# Altium schematic sheet Photodiode.SchDoc
size 420 x 297 mm; Address1: Address1; Address2: Address2; Address3: Address3; Address4: Address4; DocumentNumber: *Э3; SheetNumber: 2; SheetTotal: 14; DocumentType: Схема электрическая *
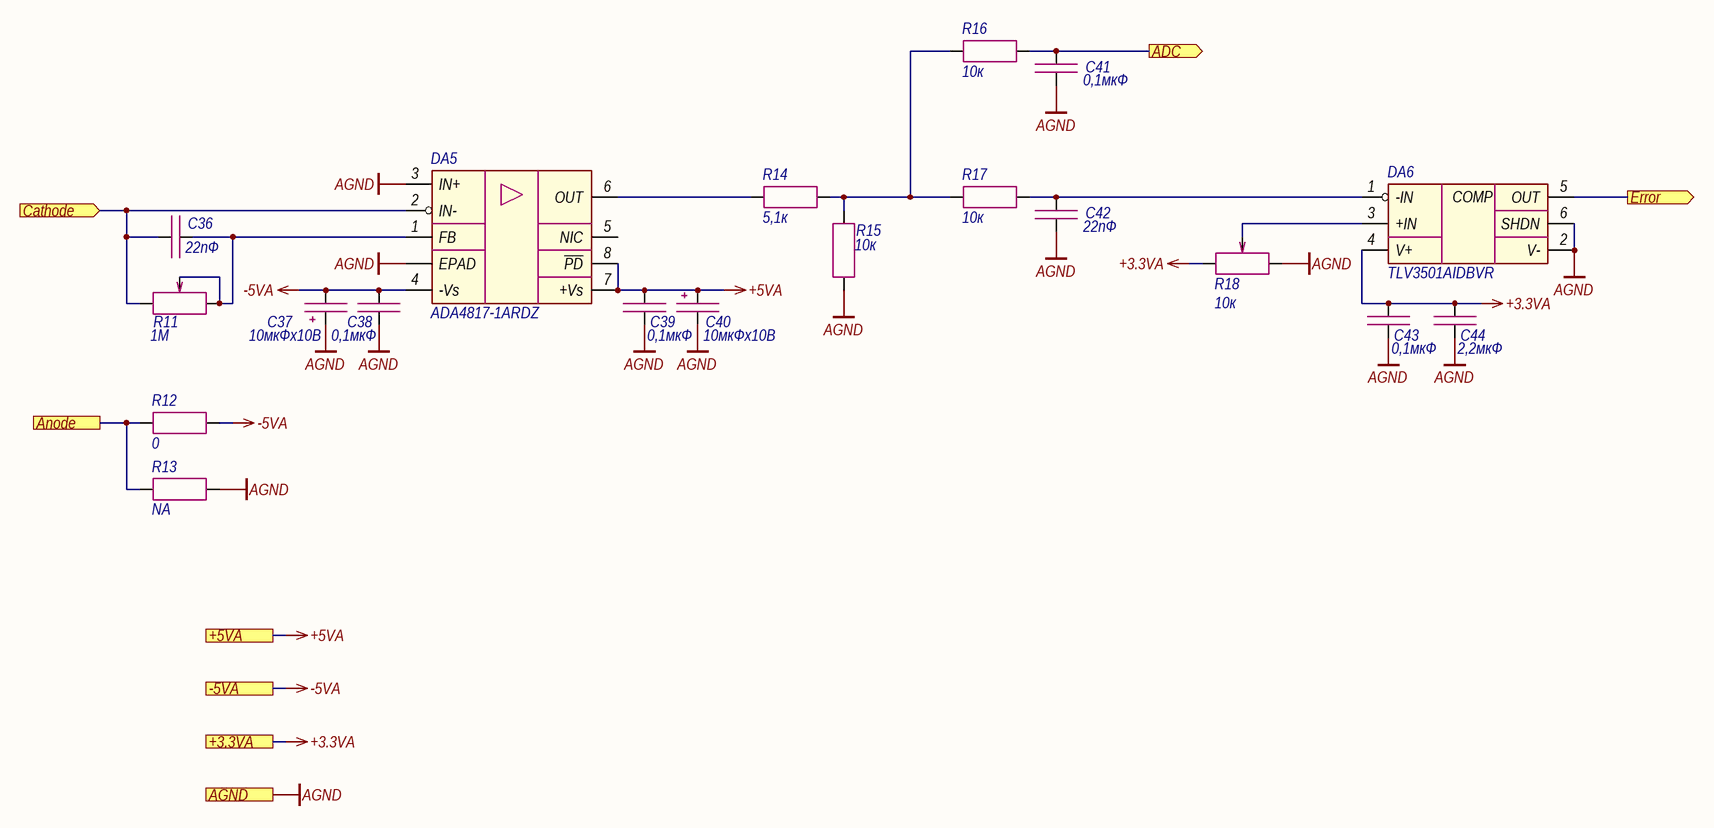
[diagram p0: Photodiode.SchDoc]

## Parts
C36  22пФ  [CAP_0603]
C37  10мкФх10B  [CAP_A]
C38  0,1мкФ  [CAP_0603]
C39  0,1мкФ  [CAP_0603]
C40  10мкФх10B  [CAP_A]
C41  0,1мкФ  [CAP_0603]
C42  22пФ  [CAP_0603]
C43  0,1мкФ  [CAP_0603]
C44  2,2мкФ  [CAP_0603]
DA5  ADA4817-1ARDZ  [SOIC-8 EPAD]
DA6  TLV3501AIDBVR  [SOT-23-6]
R11  1М  [3224W]
R12  0  [RES_0603]
R13  NA  [RES_0603]
R14  5,1к  [RES_0603]
R15  10к  [RES_0603]
R16  10к  [RES_0603]
R17  10к  [RES_0603]
R18  10к  [3224W]

## Ports
+3.3VA (see Main[2A], LD_driver[1D], Thermistor[2C]), +5VA (see Main[1A], Analog_isolation[2C], LD_driver[1D]), -5VA (see Main[1A]), ADC (out, see Main[2A]), AGND (see Main[2A], Analog_isolation[2C], LD_driver[1D], Thermistor[2C]), Anode (see Main[1A]), Cathode (in, see Main[1A]), Error (out, see Main[2A])

## Nets
+3.3VA: C43.1 C44.1 DA6.4(V+) R18.3 ; port +3.3VA
+5VA: C39.1 C40.1 DA5.7(+Vs) DA5.8(~{PD}) ; port +5VA
-5VA: C37.2 C38.1 DA5.4(-Vs) R12.1 ; port -5VA
AGND: C37.1 C38.2 C39.2 C40.2 C41.2 C42.2 C43.2 C44.2 DA5.3(IN+) DA5.EPAD DA6.2(V-) DA6.6(SHDN) R13.2 R15.2 R18.1 ; port AGND
ADC: C41.1 R16.2 ; port ADC
Anode: R12.2 R13.1 ; port Anode
Cathode: C36.2 DA5.2(IN-) R11.1 ; port Cathode
Error: DA6.5(OUT) ; port Error
NetC36_1: C36.1 DA5.1(FB) R11.2 R11.3
NetC42_1: C42.1 DA6.1(-IN) R17.2
NetDA5_6: DA5.6(OUT) R14.1
NetDA6_3: DA6.3(+IN) R18.2
NetR14_2: R14.2 R15.1 R16.1 R17.1

Not connected (* = marked no-connect by the designer): DA5 5(NIC)

## Notes on the sheet
- Подп. и дата
- Инв. № дубл.
- Взам. инв. №
- Инв. № подл.
- Изм.
- Лист
- № докум.
- Подп.
- Дата
- Копировал
- Формат А3
- (in symbol TLV3501) COMP

## Library data of the parts
C36 C42 = Capacitor: Manufacturer: Murata; Model: GRM1885C1H220JA01D; Value: 22пФ; Document: *
C37 C40 = Capacitor_Polar: Model: TECAP, 10 мкФ, 10 В, тип A, 10%; Value: 10мкФх10B; Document: *; Manufacturer: *
C38 C39 C41 C43 = Capacitor: Manufacturer: Murata; Model: GRM188R71H104KA93D; Value: 0,1мкФ; Document: *
C44 = Capacitor: Manufacturer: Murata; Model: GRM188R61H225KE11D; Value: 2,2мкФ; Document: *
DA5 = ADA4817-1ARDZ: Manufacturer: Analog Devices; Model: ADA4817-1ARDZ; Document: *
DA6 = TLV3501: Manufacturer: Texas Instruments; Model: TLV3501AIDBVR; Document: *
R11 = Resistor_Variable: Manufacturer: Bourns; Model: 3224W-1-105; Value: 1М; Document: *
R12 = Resistor: Manufacturer: Yageo; Model: RC0603FR-070RL; Value: 0; Document: *
R13 = Resistor: Value: NA; Model: *; Document: *; Manufacturer: *
R14 = Resistor: Manufacturer: Yageo; Model: RC0603FR-075K1L; Value: 5,1к; Document: *
R15-R17 = Resistor: Manufacturer: Yageo; Model: RC0603FR-0710KL; Value: 10к; Document: *
R18 = Resistor_Variable: Manufacturer: Bourns; Model: 3224W-1-103; Value: 10к; Document: *